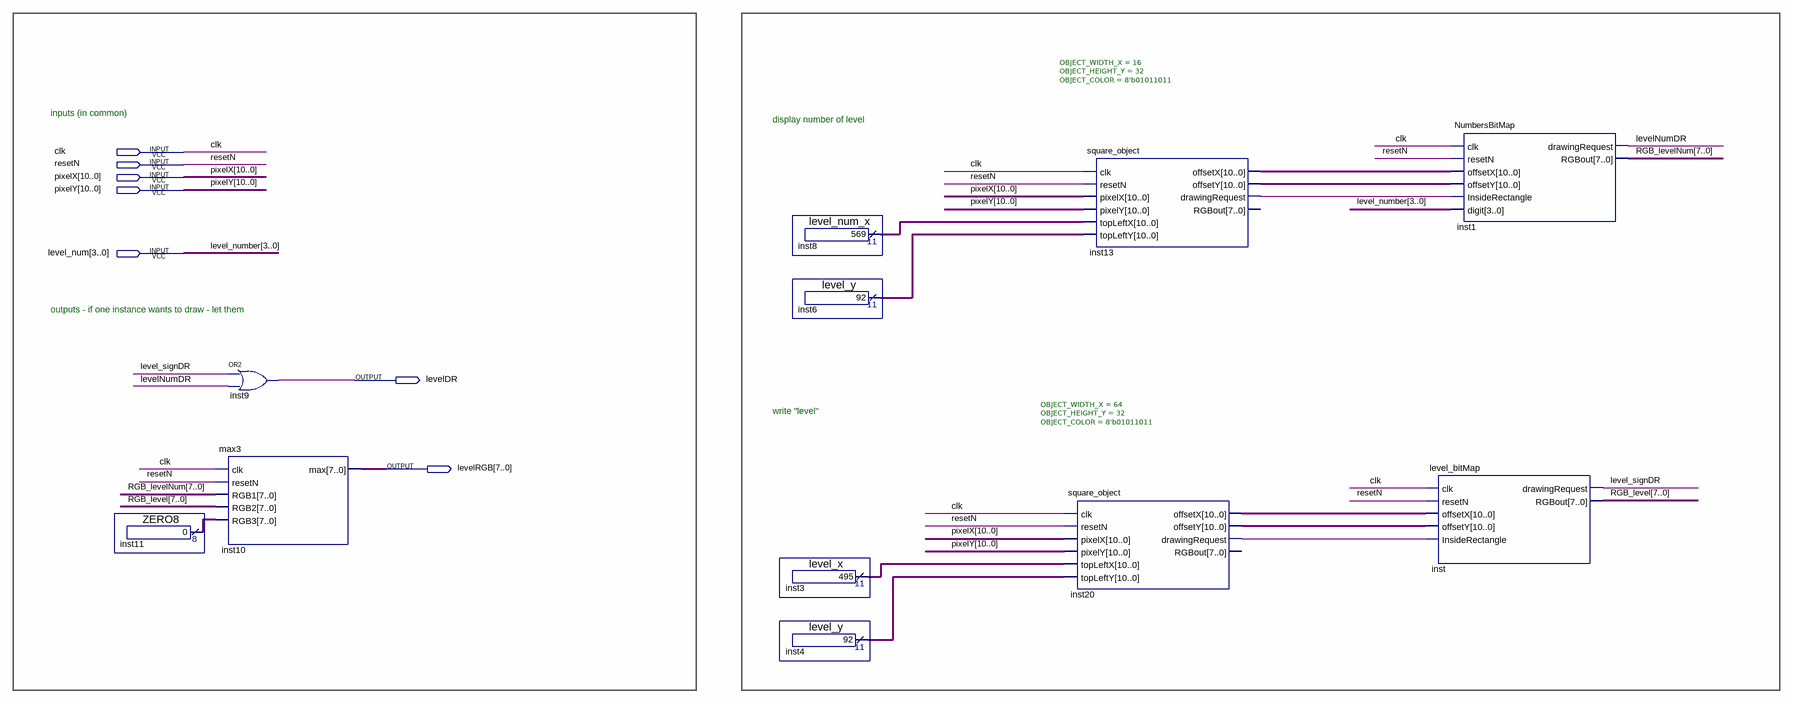
[diagram p0: schematic sheet]
// Quartus schematic LEVEL_DISPLAY.bdf as structural Verilog: 11 symbols, 7 pins
module LEVEL_DISPLAY (
  input  clk,
  input  resetN,
  input  [10:0] pixelX,
  input  [10:0] pixelY,
  input  [3:0] level_num,
  output levelDR,
  output [7:0] levelRGB
);

  wire inst13_drawingrequest, inst20_drawingrequest, level_signDR, levelNumDR;
  wire [7:0] inst11_result, RGB_level, RGB_levelNum;
  wire [10:0] inst3_result, inst4_result, inst6_result, inst8_result, inst13_offsetx, inst13_offsety,
       inst20_offsetx, inst20_offsety;

  ZERO8 inst11 (.result(inst11_result));
  or inst9 (levelDR, level_signDR, levelNumDR);
  max3 inst10 (.clk(clk), .resetN(resetN), .RGB1(RGB_levelNum), .RGB2(RGB_level), .RGB3(inst11_result), .max(levelRGB));
  level_num_x inst8 (.result(inst8_result));
  level_y inst6 (.result(inst6_result));
  level_x inst3 (.result(inst3_result));
  level_y inst4 (.result(inst4_result));
  square_object #(.OBJECT_WIDTH_X(64), .OBJECT_HEIGHT_Y(32), .OBJECT_COLOR(8'b01011011)) inst20 (
    .clk(clk), .resetN(resetN), .pixelX(pixelX), .pixelY(pixelY), .topLeftX(inst3_result),
    .topLeftY(inst4_result), .offsetX(inst20_offsetx), .offsetY(inst20_offsety),
    .drawingRequest(inst20_drawingrequest));  // open: RGBout
  square_object #(.OBJECT_WIDTH_X(16), .OBJECT_HEIGHT_Y(32), .OBJECT_COLOR(8'b01011011)) inst13 (
    .clk(clk), .resetN(resetN), .pixelX(pixelX), .pixelY(pixelY), .topLeftX(inst8_result),
    .topLeftY(inst6_result), .offsetX(inst13_offsetx), .offsetY(inst13_offsety),
    .drawingRequest(inst13_drawingrequest));  // open: RGBout
  NumbersBitMap inst1 (
    .clk(clk), .resetN(resetN), .offsetX(inst13_offsetx), .offsetY(inst13_offsety),
    .InsideRectangle(inst13_drawingrequest), .digit(level_num), .drawingRequest(levelNumDR),
    .RGBout(RGB_levelNum));
  level_bitMap inst (
    .clk(clk), .resetN(resetN), .offsetX(inst20_offsetx), .offsetY(inst20_offsety),
    .InsideRectangle(inst20_drawingrequest), .drawingRequest(level_signDR), .RGBout(RGB_level));

  // Other names for the same wires on the sheet: level_number[3:0] = level_num

  // Notes on the sheet:
  //   inputs (in common)
  //   display number of level
  //   outputs - if one instance wants to draw - let them
  //   write "level"
endmodule
